# EAGLE schematic FM_Transmitter_Eagle (EAGLE 9.6.2)
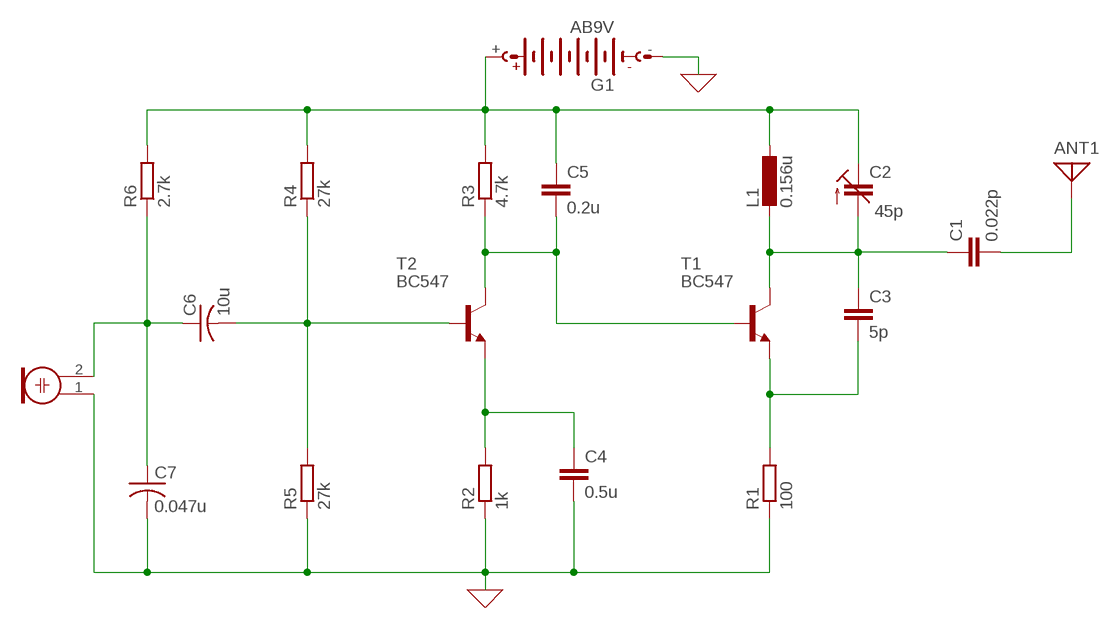
[diagram p0: schematic, sheet 1]

## Parts
ANT1  ANTENNA  [PAD-01]
C1  0.022p  C-EU025-024X044  [C025-024X044]
C2  45p  C-TRIMM808  [CTRIM808-BC]
C3  5p  C-EU025-024X044  [C025-024X044]
C4  0.5u  C-EU025-024X044  [C025-024X044]
C5  0.2u  C-EU025-024X044  [C025-024X044]
C6  10u  C-US025-024X044  [C025-024X044]
C7  0.047u  C-US025-024X044  [C025-024X044]
G1  AB9V  [AB9V]
L1  0.156u  L-EU0204/5  [0204/5]
M1  ELECTRET_MICROPHON-F6050AP  [F6050AP]
R1  100  R-EU_0204/7  [0204/7]
R2  1k  R-EU_0204/7  [0204/7]
R3  4.7k  R-EU_0204/7  [0204/7]
R4  27k  R-EU_0204/7  [0204/7]
R5  27k  R-EU_0204/7  [0204/7]
R6  2.7k  R-EU_0204/7  [0204/7]
T1  BC547  [TO92]
T2  BC547  [TO92]

## Nets
0: C4.2 C7.2 G1.- M1.1 R1.1 R2.1 R5.1 ; supply symbol labelled GND
N$1: ANT1.1 C1.2
N$2: C6.1 C7.1 M1.2 R6.1
N$3: C1.1 C2.2(A) C3.1 L1.2 T1.3(C)
N$4: C3.2 R1.2 T1.1(E)
N$5: C4.1 R2.2 T2.1(E)
N$6: C5.2 R3.1 T1.2(B) T2.3(C)
N$7: C6.2 R4.1 R5.2 T2.2(B)
N$8: C2.1(E) C5.1 G1.+ L1.1 R3.2 R4.2 R6.2

## Library data of the parts
ANT1 = discrete:ANTENNA: Antenna
C1 C3-C5 = rcl:C-EU: CAPACITOR, European symbol; SPICEPREFIX: C
C2 = rcl:C-TRIMM: Trimm capacitor; SPICEPREFIX: C
C6 C7 = rcl:C-US: CAPACITOR, American symbol; SPICEPREFIX: C
G1 = battery:AB9V: 9-V BATTERY CLIP
L1 = rcl:L-EU: INDUCTOR, European symbol; SPICEPREFIX: L
M1 = microphon:ELECTRET_MICROPHON-: Electret Condenser Microphone
R1-R6 = rcl:R-EU_: RESISTOR, European symbol; SPICEPREFIX: R
T1 T2 = transistor:BC547: NPN TRANSISTOR